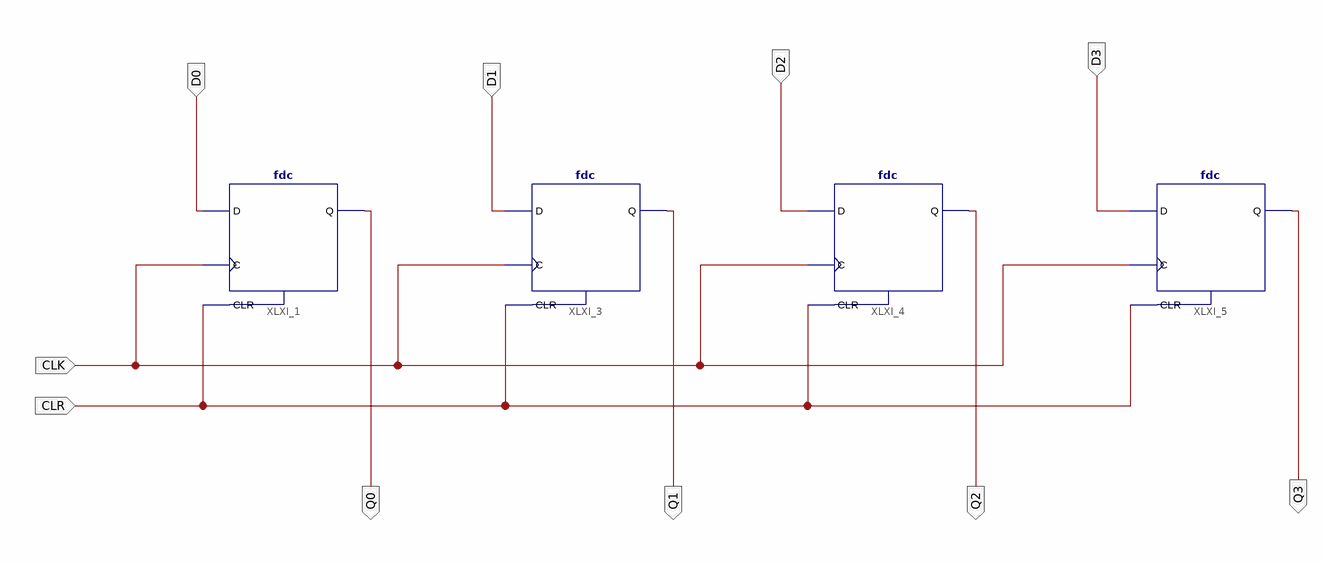
[diagram p0: schematic sheet 1]
// Xilinx ISE schematic Register_4bit.sch (spartan3e) as structural Verilog: 4 symbols, 10 ports
module Register_4bit (
  input  CLR,
  input  CLK,
  input  D0,
  input  D1,
  input  D2,
  input  D3,
  output Q1,
  output Q2,
  output Q3,
  output Q0
);

  fdc XLXI_1 (.C(CLK), .CLR(CLR), .D(D0), .Q(Q0));
  fdc XLXI_3 (.C(CLK), .CLR(CLR), .D(D1), .Q(Q1));
  fdc XLXI_4 (.C(CLK), .CLR(CLR), .D(D2), .Q(Q2));
  fdc XLXI_5 (.C(CLK), .CLR(CLR), .D(D3), .Q(Q3));
endmodule
